# Altium schematic sheet APP_1_ADC.SchDoc
size Tabloid; SheetNumber: 11; SheetTotal: 11; Sheet_Name: ADC; Size: 11x17
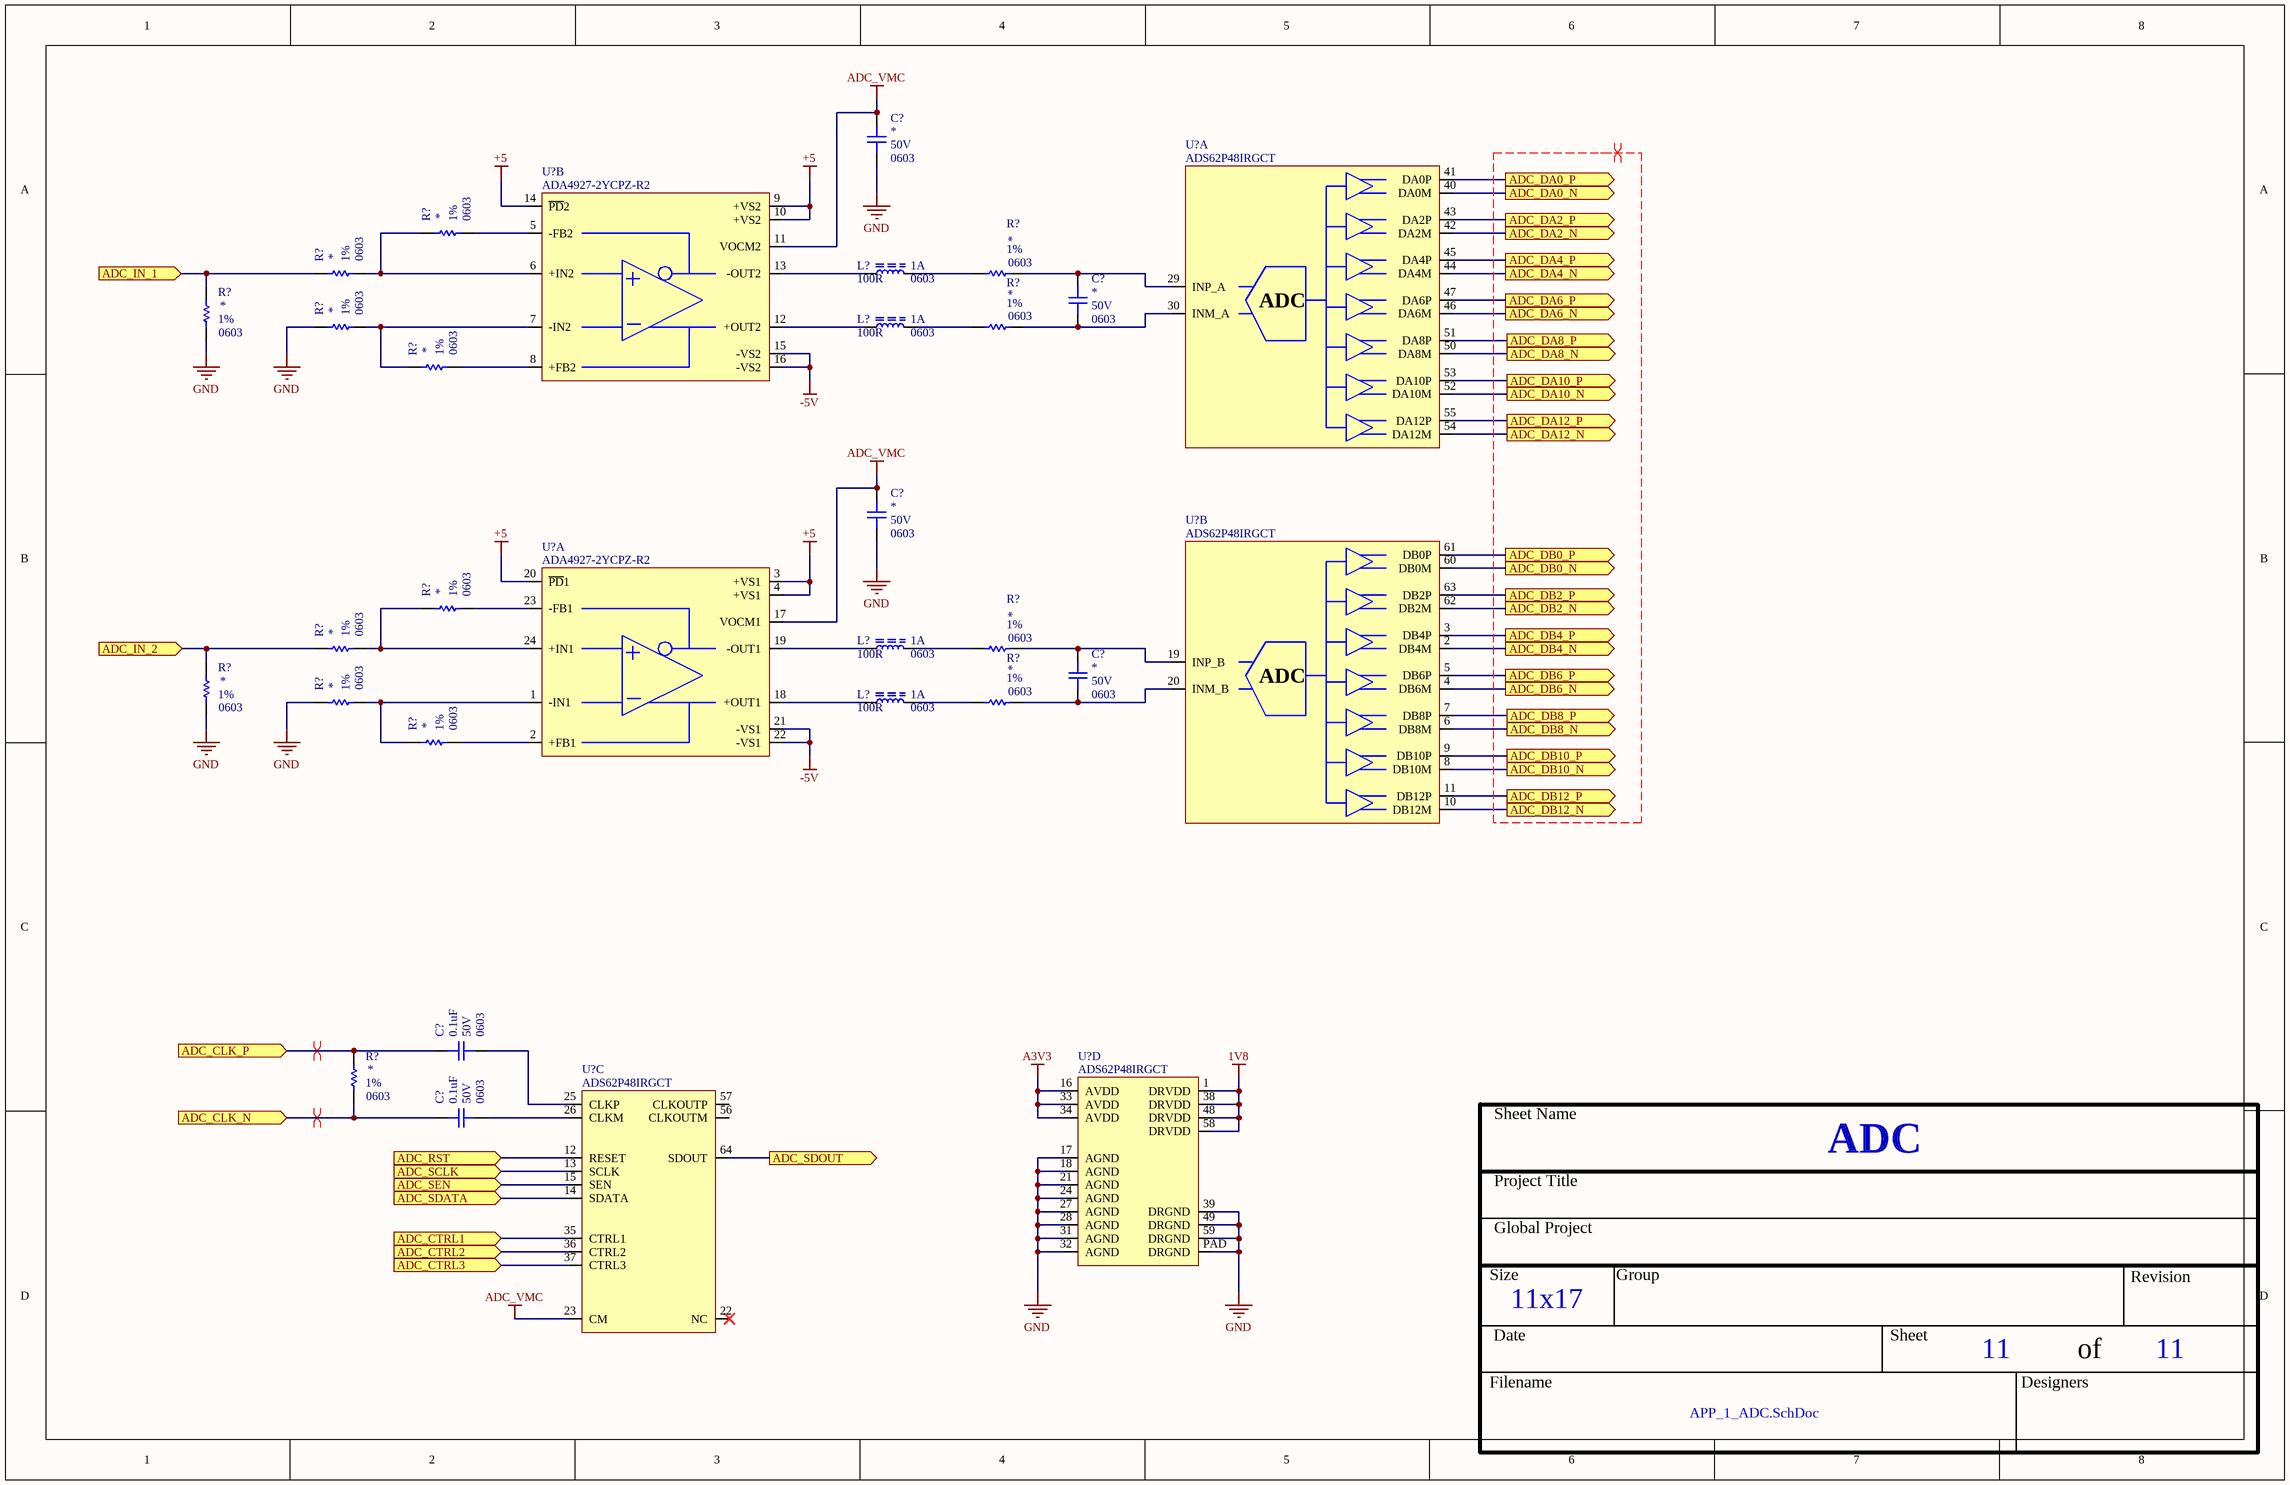
[diagram p0: APP_1_ADC.SchDoc]

## Parts
(Parts that share a designator on the sheet are numbered #1, #2 ... from top to bottom, then left to right.)
C?#1  Voltage: 50V  Package: 0603  [CAP_0603]  (hidden comment: CAP - 0603)
C?#2  Voltage: 50V  Package: 0603  [CAP_0603]  (hidden comment: CAP - 0603)
C?#3  Voltage: 50V  Package: 0603  [CAP_0603]  (hidden comment: CAP - 0603)
C?#4  Voltage: 50V  Package: 0603  [CAP_0603]  (hidden comment: CAP - 0603)
C?#5  value 0.1uF  Voltage: 50V  Package: 0603  [CAP_0603]  (hidden comment: CAP - 0603)
C?#6  value 0.1uF  Voltage: 50V  Package: 0603  [CAP_0603]  (hidden comment: CAP - 0603)
L?#1  value 100R  Current: 1A  Package: 0603  [FER_0603]  (hidden comment: FER - 0603)
L?#2  value 100R  Current: 1A  Package: 0603  [FER_0603]  (hidden comment: FER - 0603)
L?#3  value 100R  Current: 1A  Package: 0603  [FER_0603]  (hidden comment: FER - 0603)
L?#4  value 100R  Current: 1A  Package: 0603  [FER_0603]  (hidden comment: FER - 0603)
R?#1  Package: 0603  Precision: 1%  [RES_0603]  (hidden comment: RES - 0603)
R?#2  Package: 0603  Precision: 1%  [RES_0603]  (hidden comment: RES - 0603)
R?#3  Package: 0603  Precision: 1%  [RES_0603]  (hidden comment: RES - 0603)
R?#4  Package: 0603  Precision: 1%  [RES_0603]  (hidden comment: RES - 0603)
R?#5  Package: 0603  Precision: 1%  [RES_0603]  (hidden comment: RES - 0603)
R?#6  Package: 0603  Precision: 1%  [RES_0603]  (hidden comment: RES - 0603)
R?#7  Package: 0603  Precision: 1%  [RES_0603]  (hidden comment: RES - 0603)
R?#8  Package: 0603  Precision: 1%  [RES_0603]  (hidden comment: RES - 0603)
R?#9  Package: 0603  Precision: 1%  [RES_0603]  (hidden comment: RES - 0603)
R?#10  Package: 0603  Precision: 1%  [RES_0603]  (hidden comment: RES - 0603)
R?#11  Package: 0603  Precision: 1%  [RES_0603]  (hidden comment: RES - 0603)
R?#12  Package: 0603  Precision: 1%  [RES_0603]  (hidden comment: RES - 0603)
R?#13  Package: 0603  Precision: 1%  [RES_0603]  (hidden comment: RES - 0603)
R?#14  Package: 0603  Precision: 1%  [RES_0603]  (hidden comment: RES - 0603)
R?#15  Package: 0603  Precision: 1%  [RES_0603]  (hidden comment: RES - 0603)
U?#1  ADS62P48IRGCT  [ADC_ADS62P48IRGCT]  (part A of 4)
U?#2  ADA4927-2YCPZ-R2  [OPAMP_ADA4927-2YCPZ-R2]  (part B of 2)
U?#3  ADS62P48IRGCT  [ADC_ADS62P48IRGCT]  (part B of 4)
U?#4  ADA4927-2YCPZ-R2  [OPAMP_ADA4927-2YCPZ-R2]  (part A of 2)
U?#5  ADS62P48IRGCT  [ADC_ADS62P48IRGCT]  (part D of 4)
U?#6  ADS62P48IRGCT  [ADC_ADS62P48IRGCT]  (part C of 4)

## Ports
ADC_CLK_N (in), ADC_CLK_P (in), ADC_CTRL1 (in), ADC_CTRL2 (in), ADC_CTRL3 (in), ADC_DA0_N (out), ADC_DA0_P (out), ADC_DA2_N (out), ADC_DA2_P (out), ADC_DA4_N (out), ADC_DA4_P (out), ADC_DA6_N (out), ADC_DA6_P (out), ADC_DA8_N (out), ADC_DA8_P (out), ADC_DA10_N (out), ADC_DA10_P (out), ADC_DA12_N (out), ADC_DA12_P (out), ADC_DB0_N (out), ADC_DB0_P (out), ADC_DB2_N (out), ADC_DB2_P (out), ADC_DB4_N (out), ADC_DB4_P (out), ADC_DB6_N (out), ADC_DB6_P (out), ADC_DB8_N (out), ADC_DB8_P (out), ADC_DB10_N (out), ADC_DB10_P (out), ADC_DB12_N (out), ADC_DB12_P (out), ADC_IN_1 (in, see APP_1_Connectors_e[2C]), ADC_IN_2 (in, see APP_1_Connectors_e[2D]), ADC_RST (in), ADC_SCLK (in), ADC_SDATA (in), ADC_SDOUT (out), ADC_SEN (in)

## Nets
1V8: U?#5.1(DRVDD) U?#5.38(DRVDD) U?#5.48(DRVDD) U?#5.58(DRVDD)
+5: U?#2.9(+VS2) U?#2.10(+VS2) U?#2.14(~{PD}2) U?#4.3(+VS1) U?#4.4(+VS1) U?#4.20(~{PD}1)
-5V: U?#2.15(-VS2) U?#2.16(-VS2) U?#4.21(-VS1) U?#4.22(-VS1)
A3V3: U?#5.16(AVDD) U?#5.33(AVDD) U?#5.34(AVDD)
ADC_VMC: C?#1.2 C?#3.2 U?#2.11(VOCM2) U?#4.17(VOCM1) U?#6.23(CM)
GND: C?#1.1 C?#3.1 R?#4.1 R?#5.2 R?#11.1 R?#12.2 U?#5.17(AGND) U?#5.18(AGND) U?#5.21(AGND) U?#5.24(AGND) U?#5.27(AGND) U?#5.28(AGND) U?#5.31(AGND) U?#5.32(AGND) U?#5.39(DRGND) U?#5.49(DRGND) U?#5.59(DRGND) U?#5.PAD(DRGND)
ADC_CLK_N: C?#6.2 R?#15.1 ; port ADC_CLK_N
ADC_CLK_P: C?#5.2 R?#15.2 ; port ADC_CLK_P
ADC_CTRL1: U?#6.35(CTRL1) ; port ADC_CTRL1
ADC_CTRL2: U?#6.36(CTRL2) ; port ADC_CTRL2
ADC_CTRL3: U?#6.37(CTRL3) ; port ADC_CTRL3
ADC_DA0_N: U?#1.40(DA0M) ; port ADC_DA0_N
ADC_DA0_P: U?#1.41(DA0P) ; port ADC_DA0_P
ADC_DA2_N: U?#1.42(DA2M) ; port ADC_DA2_N
ADC_DA2_P: U?#1.43(DA2P) ; port ADC_DA2_P
ADC_DA4_N: U?#1.44(DA4M) ; port ADC_DA4_N
ADC_DA4_P: U?#1.45(DA4P) ; port ADC_DA4_P
ADC_DA6_N: U?#1.46(DA6M) ; port ADC_DA6_N
ADC_DA6_P: U?#1.47(DA6P) ; port ADC_DA6_P
ADC_DA8_N: U?#1.50(DA8M) ; port ADC_DA8_N
ADC_DA8_P: U?#1.51(DA8P) ; port ADC_DA8_P
ADC_DA10_N: U?#1.52(DA10M) ; port ADC_DA10_N
ADC_DA10_P: U?#1.53(DA10P) ; port ADC_DA10_P
ADC_DA12_N: U?#1.54(DA12M) ; port ADC_DA12_N
ADC_DA12_P: U?#1.55(DA12P) ; port ADC_DA12_P
ADC_DB0_N: U?#3.60(DB0M) ; port ADC_DB0_N
ADC_DB0_P: U?#3.61(DB0P) ; port ADC_DB0_P
ADC_DB2_N: U?#3.62(DB2M) ; port ADC_DB2_N
ADC_DB2_P: U?#3.63(DB2P) ; port ADC_DB2_P
ADC_DB4_N: U?#3.2(DB4M) ; port ADC_DB4_N
ADC_DB4_P: U?#3.3(DB4P) ; port ADC_DB4_P
ADC_DB6_N: U?#3.4(DB6M) ; port ADC_DB6_N
ADC_DB6_P: U?#3.5(DB6P) ; port ADC_DB6_P
ADC_DB8_N: U?#3.6(DB8M) ; port ADC_DB8_N
ADC_DB8_P: U?#3.7(DB8P) ; port ADC_DB8_P
ADC_DB10_N: U?#3.8(DB10M) ; port ADC_DB10_N
ADC_DB10_P: U?#3.9(DB10P) ; port ADC_DB10_P
ADC_DB12_N: U?#3.10(DB12M) ; port ADC_DB12_N
ADC_DB12_P: U?#3.11(DB12P) ; port ADC_DB12_P
ADC_IN_1: R?#2.2 R?#4.2 ; port ADC_IN_1
ADC_IN_2: R?#9.2 R?#11.2 ; port ADC_IN_2
ADC_RST: U?#6.12(RESET) ; port ADC_RST
ADC_SCLK: U?#6.13(SCLK) ; port ADC_SCLK
ADC_SDATA: U?#6.14(SDATA) ; port ADC_SDATA
ADC_SDOUT: U?#6.64(SDOUT) ; port ADC_SDOUT
ADC_SEN: U?#6.15(SEN) ; port ADC_SEN
NetC?#2_1: C?#2.1 R?#6.1 U?#1.30(INM_A)
NetC?#2_2: C?#2.2 R?#3.1 U?#1.29(INP_A)
NetC?#4_1: C?#4.1 R?#13.1 U?#3.20(INM_B)
NetC?#4_2: C?#4.2 R?#10.1 U?#3.19(INP_B)
NetC?#5_1: C?#5.1 U?#6.25(CLKP)
NetC?#6_1: C?#6.1 U?#6.26(CLKM)
NetL?#1_1: L?#1.1 R?#3.2
NetL?#1_2: L?#1.2 U?#2.13(-OUT2)
NetL?#2_1: L?#2.1 R?#6.2
NetL?#2_2: L?#2.2 U?#2.12(+OUT2)
NetL?#3_1: L?#3.1 R?#10.2
NetL?#3_2: L?#3.2 U?#4.19(-OUT1)
NetL?#4_1: L?#4.1 R?#13.2
NetL?#4_2: L?#4.2 U?#4.18(+OUT1)
NetR?#1_1: R?#1.1 U?#2.5(-FB2)
NetR?#1_2: R?#1.2 R?#2.1 U?#2.6(+IN2)
NetR?#5_1: R?#5.1 R?#7.2 U?#2.7(-IN2)
NetR?#7_1: R?#7.1 U?#2.8(+FB2)
NetR?#8_1: R?#8.1 U?#4.23(-FB1)
NetR?#8_2: R?#8.2 R?#9.1 U?#4.24(+IN1)
NetR?#12_1: R?#12.1 R?#14.2 U?#4.1(-IN1)
NetR?#14_1: R?#14.1 U?#4.2(+FB1)

Not connected (* = marked no-connect by the designer): U?#6 22(NC)* 56(CLKOUTM) 57(CLKOUTP)

## Layout directives
differential pair: (no net found under the mark), ADC_CLK_N, ADC_CLK_P

## Notes on the sheet
- Sheet Name
- Project Title
- Global Project
- Size
- Group
- Revision
- Date
- Sheet
- of
- Filename
- Designers
- (in symbol ADC_ADS62P48IRGCT, part A) ADC
- (in symbol ADC_ADS62P48IRGCT, part B) ADC

## Library data of the parts
C?#1-C?#6 = CAP - 0603: Precision: 10%; Current: *; CreatedBy: Jonathan Bouchard; Power: *
  C?#1-C?#4: Value: *
U?#1 U?#3 U?#5 U?#6 = ADC_ADS62P48IRGCT: ADC - 14 BIT 210MSPS SUAL - VQFN-64; Voltage: 3.15 V ~ 3.6 V / 1.7 V ~ 1.9 V; Mfg: Texas Instruments; Precision: 14 Bit; Current: *; Power: *; Mfg Part Number: ADS62P48IRGCT; HelpURL: http://www.ti.com/lit/ds/symlink/ads62p48.pdf; CreatedBy: Jonathan Bouchard; Temperature: -40°C ~ 85°C; Value: *; Package: VQFN-64; Supplier 1: Digikey; Supplier Part Number 1: 296-24611-1-ND
U?#2 U?#4 = OPAMP_ADA4927-2YCPZ-R2: OPAMP - CFA 2.3GHZ - QFN-24; Voltage: 4.5 V ~ 11 V, ±2.25 V ~ 5.5 V; Current: 65mA; Mfg: Analog Devices; Power: *; Mfg Part Number: ADA4927-2YCPZ-R2; HelpURL: http://www.analog.com/media/en/technical-documentation/data-sheets/ADA4927-1_4927-2.pdf; CreatedBy: Jonathan Bouchard; Temperature: -40°C ~ 105°C; Value: *; Precision: *; Package: QFN-24; Supplier 1: Digikey; Supplier Part Number 1: ADA4927-2YCPZ-R2CT-ND
L?#1-L?#4 = FER - 0603: Voltage: *; CreatedBy: Jonathan Bouchard; Power: *; Precision: *
R?#1-R?#15 = RES - 0603: Current: *; CreatedBy: Jonathan Bouchard; Value: *